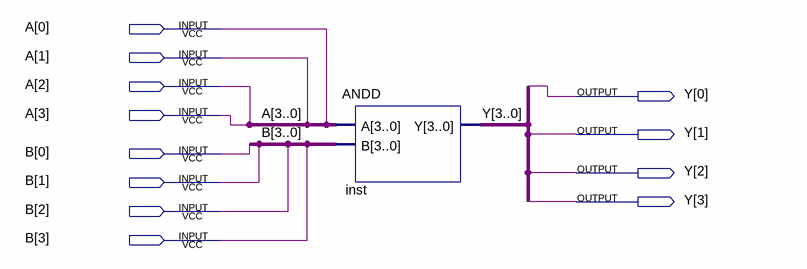
[diagram p0: schematic sheet]
// Quartus schematic ANDDblock.bdf as structural Verilog: 1 symbols, 12 pins
module ANDDblock (
  input  [3:0] A,
  input  [3:0] B,
  output [3:0] Y
);

  ANDD inst (.A(A), .B(B), .Y(Y));
endmodule
